# EAGLE design PhotoRectifier (EAGLE 5.11)
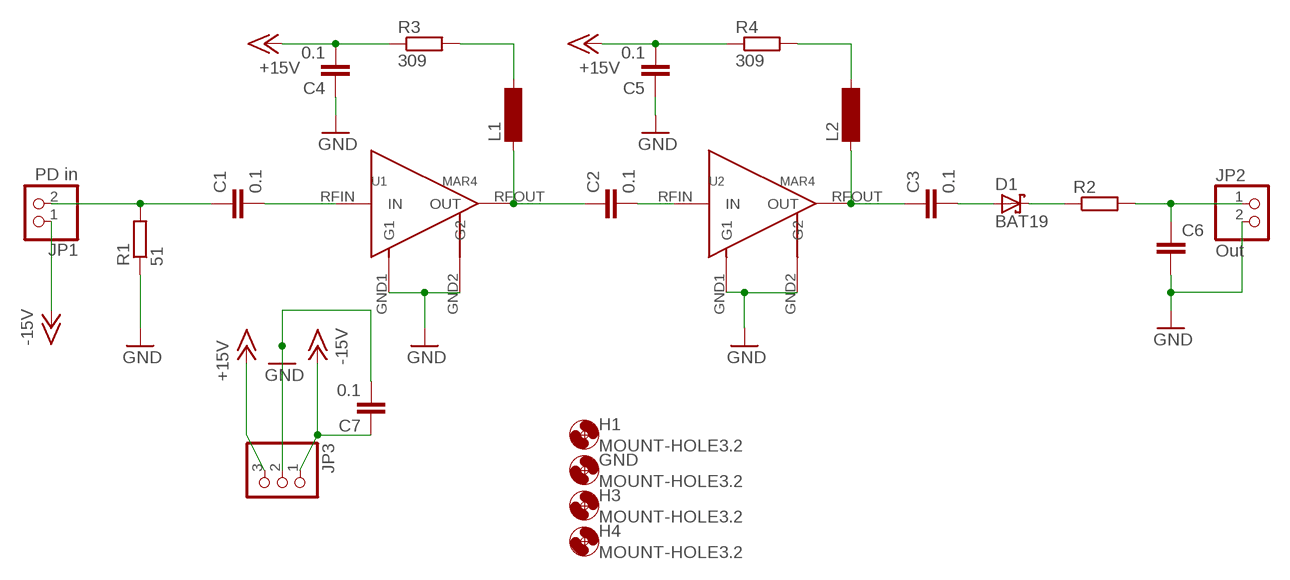
[diagram p0: schematic, sheet 1]

## Parts
C1  0.1  C-EUC0805  [C0805]
C2  0.1  C-EUC0805  [C0805]
C3  0.1  C-EUC0805  [C0805]
C4  0.1  C-EUC0805  [C0805]
C5  0.1  C-EUC0805  [C0805]
C6  C-EUC0805  [C0805]
C7  0.1  C-EU025-025X050  [C025-025X050]
D1  BAT19  [DO35-10]
GND  MOUNT-HOLE3.2  [3,2]
H1  MOUNT-HOLE3.2  [3,2]
H3  MOUNT-HOLE3.2  [3,2]
H4  MOUNT-HOLE3.2  [3,2]
JP1  PD in  PINHD-1X2  [1X02]
JP2  Out  PINHD-1X2  [1X02]
JP3  PINHD-1X3  [1X03]
L1  SM-1206  [SM-1206]
L2  SM-1206  [SM-1206]
R1  51  R-EU_M0805  [M0805]
R2  R-EU_0204/7  [0204/7]
R3  309  R-EU_R1206  [R1206]
R4  309  R-EU_R1206  [R1206]
U1  MAR4  [VV105]
U2  MAR4  [VV105]

## Nets
+15V: C4.2 C5.2 JP3.3 R3.1 R4.1
-15V: C7.1 JP1.1 JP3.1
GND: C4.1 C5.1 C6.2 C7.2 JP2.2 JP3.2 R1.1 U1.GND1(G1) U1.GND2(G2) U2.GND1(G1) U2.GND2(G2)
N$1: C1.1 JP1.2 R1.2
N$2: C1.2 U1.RFIN(IN)
N$3: L1.2 R3.2
N$4: C2.1 L1.1 U1.RFOUT(OUT)
N$5: C2.2 U2.RFIN(IN)
N$7: L2.2 R4.2
N$8: C3.1 L2.1 U2.RFOUT(OUT)
N$9: C3.2 D1.A
N$10: D1.C R2.1
N$11: C6.1 JP2.1 R2.2

## Library data of the parts
C1-C7 = rcl:C-EU: CAPACITOR, European symbol
D1 = diode:BAT19: DIODE barrier diode
GND H1 H3 H4 = holes:MOUNT-HOLE: MOUNTING HOLE with drill center marker
JP1 JP2 = pinhead:PINHD-1X2: PIN HEADER
JP3 = pinhead:PINHD-1X3: PIN HEADER
L1 L2 = inductor-neosid:SM-1206: INDUCTOR SMD chip inductor; OC_FARNELL: unknown; OC_NEWARK: unknown
R1-R4 = rcl:R-EU_: RESISTOR, European symbol
U1 U2 = custom_parts:MAR4: MiniCircuits MAR4 (and other) amplifier

## Board
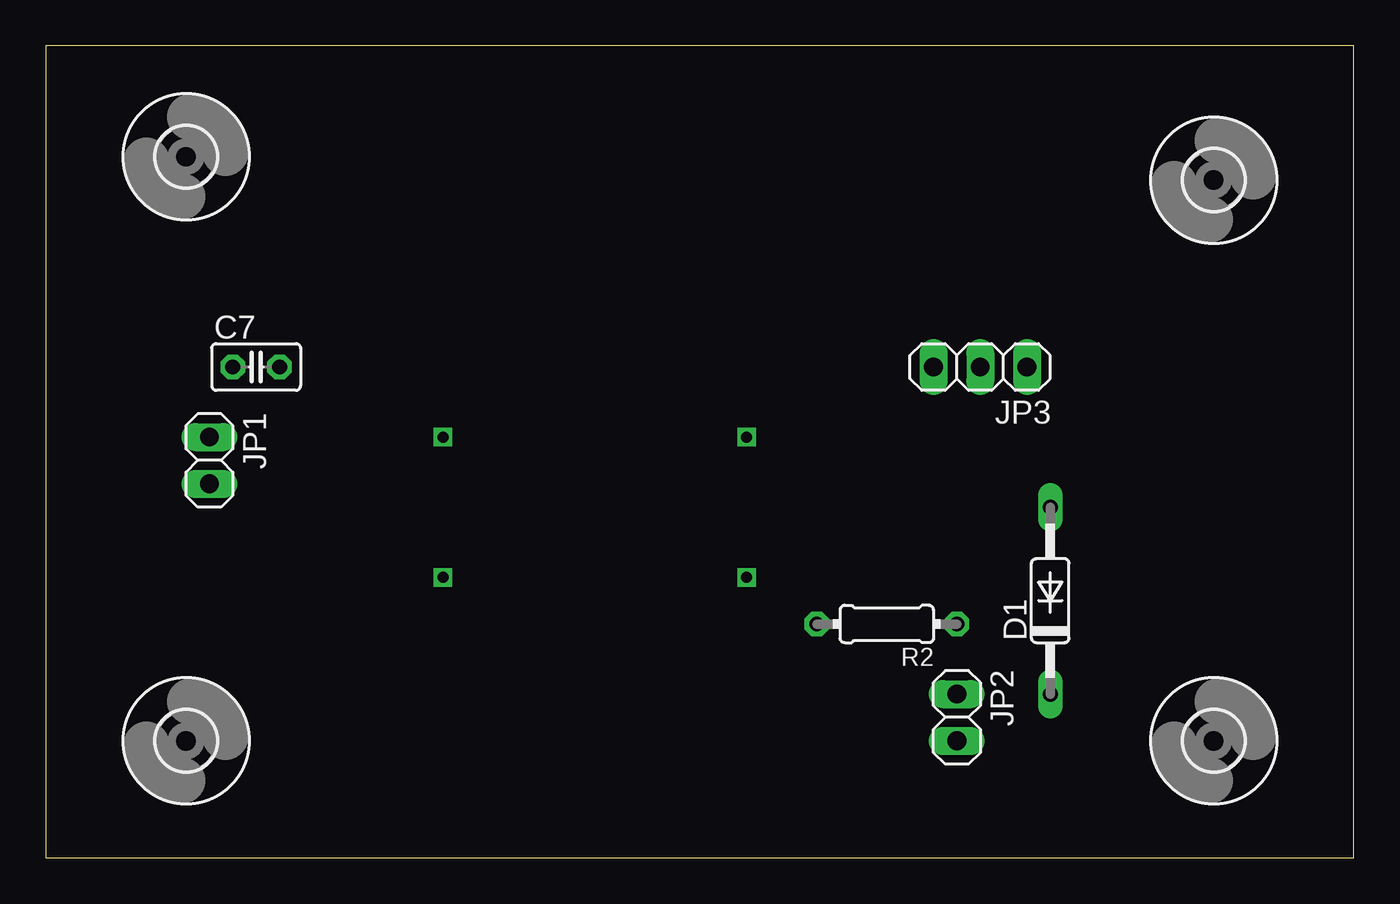
[diagram p1: board, top side]
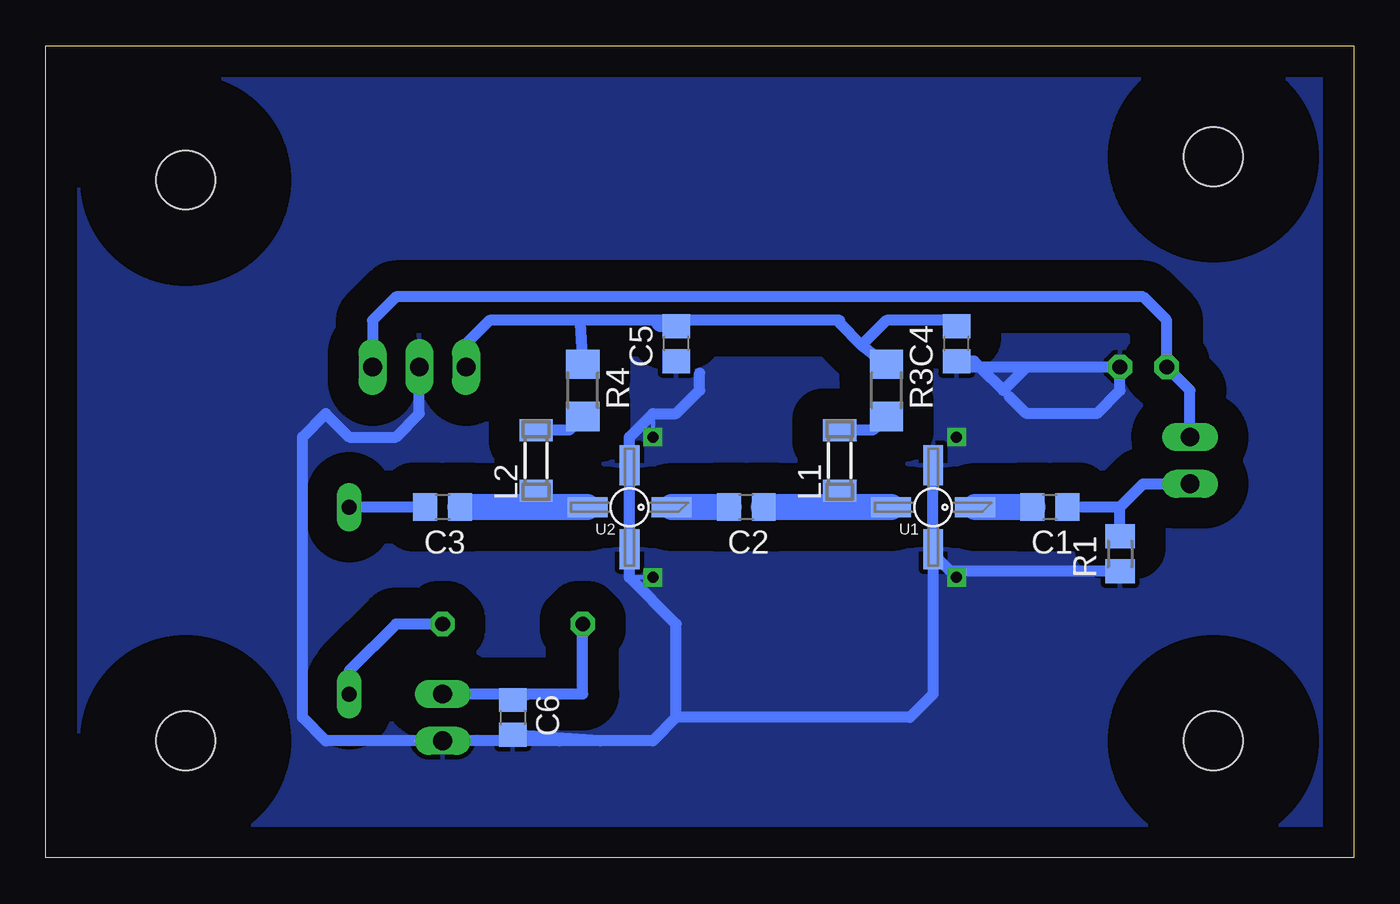
[diagram p2: board, bottom side, seen from below]

Size 71.1 x 44.12 mm. Coordinates in mm from the lower left corner, seen from the top.
Outline: 0,0 71.1,0 71.1,44.12 0,44.12 0,0
Copper layers (1*16): Top 0.035mm / dielectric 1.5mm / Bottom 0.035mm
Design rules "default": minimum track width 10mil, minimum drill 24mil, track to track 8mil, track to pad 8mil, pad to pad 8mil, via to via 8mil, smd to smd 8mil, copper to edge 40mil, drill to drill 8mil, minimum pad ring 10mil, minimum via ring 8mil, stop-mask expansion 4mil, vias tented up to drill 0mil, thermal gap 10mil

### Footprints (pad centres in the part's own frame; a part is rotated, then mirrored left to right if it is on the bottom)
C0805 = smd 1.3 x 1.5: 1 -0.95,0; 2 0.95,0
C025-025X050 = drill 0.813 octagon: 1 -1.27,0; 2 1.27,0
DO35-10 = drill 0.813 long: A 5.08,0; C -5.08,0
3,2 = hole 3.2: 0,0
1X02 = drill 1.016 long: 1 -1.27,0; 2 1.27,0
1X03 = drill 1.016 long: 1 -2.54,0; 2 0,0; 3 2.54,0
SM-1206 = smd 1.2 x 1.8: 1 -1.65,0; 2 1.65,0
M0805 = smd 1.3 x 1.6: 1 -0.95,0; 2 0.95,0
0204/7 = drill 0.813 octagon: 1 -3.81,0; 2 3.81,0
R1206 = smd 1.6 x 1.803: 1 -1.422,0; 2 1.422,0
VV105 = smd 1.067 x 2.184: GND1 0,2.286; GND2 0,-2.286 | smd 2.184 x 1.067: RFIN -2.286,0; RFOUT 2.286,0

### Placement (x,y rotation side)
C1  16.51,19.05 180 bottom
C2  33.02,19.05 180 bottom
C3  49.53,19.05 180 bottom
C4  21.59,27.94 90 bottom
C5  36.83,27.94 90 bottom
C6  45.72,7.62 270 bottom
C7  11.43,26.67 0 top
D1  54.61,13.97 90 top
GND  7.62,38.1 0 top
H1  7.62,6.35 0 top
H3  63.5,36.83 0 top
H4  63.5,6.35 0 top
JP1  8.89,21.59 270 top
JP2  49.53,7.62 270 top
JP3  50.8,26.67 180 top
L1  27.94,21.59 90 bottom
L2  44.45,21.59 90 bottom
R1  12.7,16.51 90 bottom
R2  45.72,12.7 180 top
R3  25.4,25.4 270 bottom
R4  41.91,25.4 270 bottom
U1  22.86,19.05 180 bottom
U2  39.37,19.05 180 bottom

### Tracks (layer width: path | path; a pad name or v marks a point on that pad's centre or on a via)
+15V
  Bottom 0.61: JP3.3 48.26,27.94 46.99,29.21 41.91,29.21 | 38.1,29.21 27.94,29.21 27.94,29.06 26.75,27.86 | 38.1,29.21 41.91,29.21 | 26.75,27.86 R3.1 | 26.75,27.86 25.4,29.21 21.91,29.21 C4.2 | R4.1 42.06,29.06 41.91,29.21 | C5.2 37.78,28.89 38.1,29.21
-15V
  Bottom 0.61: JP1.1 8.89,25.4 C7.1 10.16,29.21 11.43,30.48 52.07,30.48 53.34,29.21 JP3.1
GND  (via drill 0.6)
  Bottom 0.254: 39.37,15.24 v38.1,15.24 | 38.1,24.13 v38.1,22.86
  Bottom 0.61: R1.1 21.91,15.56 22.86,16.51 | 22.86,16.51 U1.GND1 U1.GND2 | 35.56,26.35 35.56,25.4 36.83,24.13 38.1,24.13 39.37,22.86 U2.GND2 U2.GND1 39.37,15.24 36.83,12.7 36.83,7.62 | 40.96,6.35 43.18,6.35 | 43.18,6.35 JP2.2 55.88,6.35 57.15,7.62 57.15,22.86 55.88,24.13 54.61,22.86 52.07,22.86 50.8,24.13 JP3.2 | 40.96,6.35 C6.2 43.18,6.35 | 36.83,7.62 38.1,6.35 40.96,6.35 | 18.73,25.08 17.78,24.13 13.97,24.13 12.7,25.4 C7.2 17.78,26.67 | 22.86,16.51 22.86,8.89 24.13,7.62 36.83,7.62 | 17.78,26.67 20.32,26.67 | 20.32,26.67 21.59,26.67 | C4.1 20.64,26.99 20.32,26.67 | 20.32,26.67 19.05,25.4 17.78,26.67
  other vias: 21.59,15.24 21.59,22.86
  pour Bottom (isolate 1.676): 1.27,1.27 1.27,43.18 69.85,43.18 69.85,1.27
N$1
  Bottom 0.61: JP1.2 11.43,20.32 12.7,19.05 | R1.2 12.7,19.05 | 12.7,19.05 C1.1
N$2
  Bottom 1.422: C1.2 U1.RFIN
N$3
  Bottom 0.61: L1.2 26.14,23.24 R3.2
N$4
  Bottom 0.61: 27.94,19.05 L1.1
  Bottom 1.422: U1.RFOUT 27.94,19.05 C2.1
N$5
  Bottom 1.422: C2.2 U2.RFIN
N$7
  Bottom 0.61: L2.2 42.65,23.24 R4.2
N$8
  Bottom 0.61: 44.45,19.05 L2.1
  Bottom 1.422: U2.RFOUT 44.45,19.05 C3.1
N$9
  Bottom 0.61: C3.2 D1.A
N$10
  Bottom 0.61: D1.C 54.61,10.16 52.07,12.7 R2.1
N$11
  Bottom 0.61: 44.77,8.89 41.91,8.89 R2.2 | 44.77,8.89 JP2.1 | 44.77,8.89 C6.1